# EAGLE schematic Final_board_R1_1 (EAGLE 7.2.0)
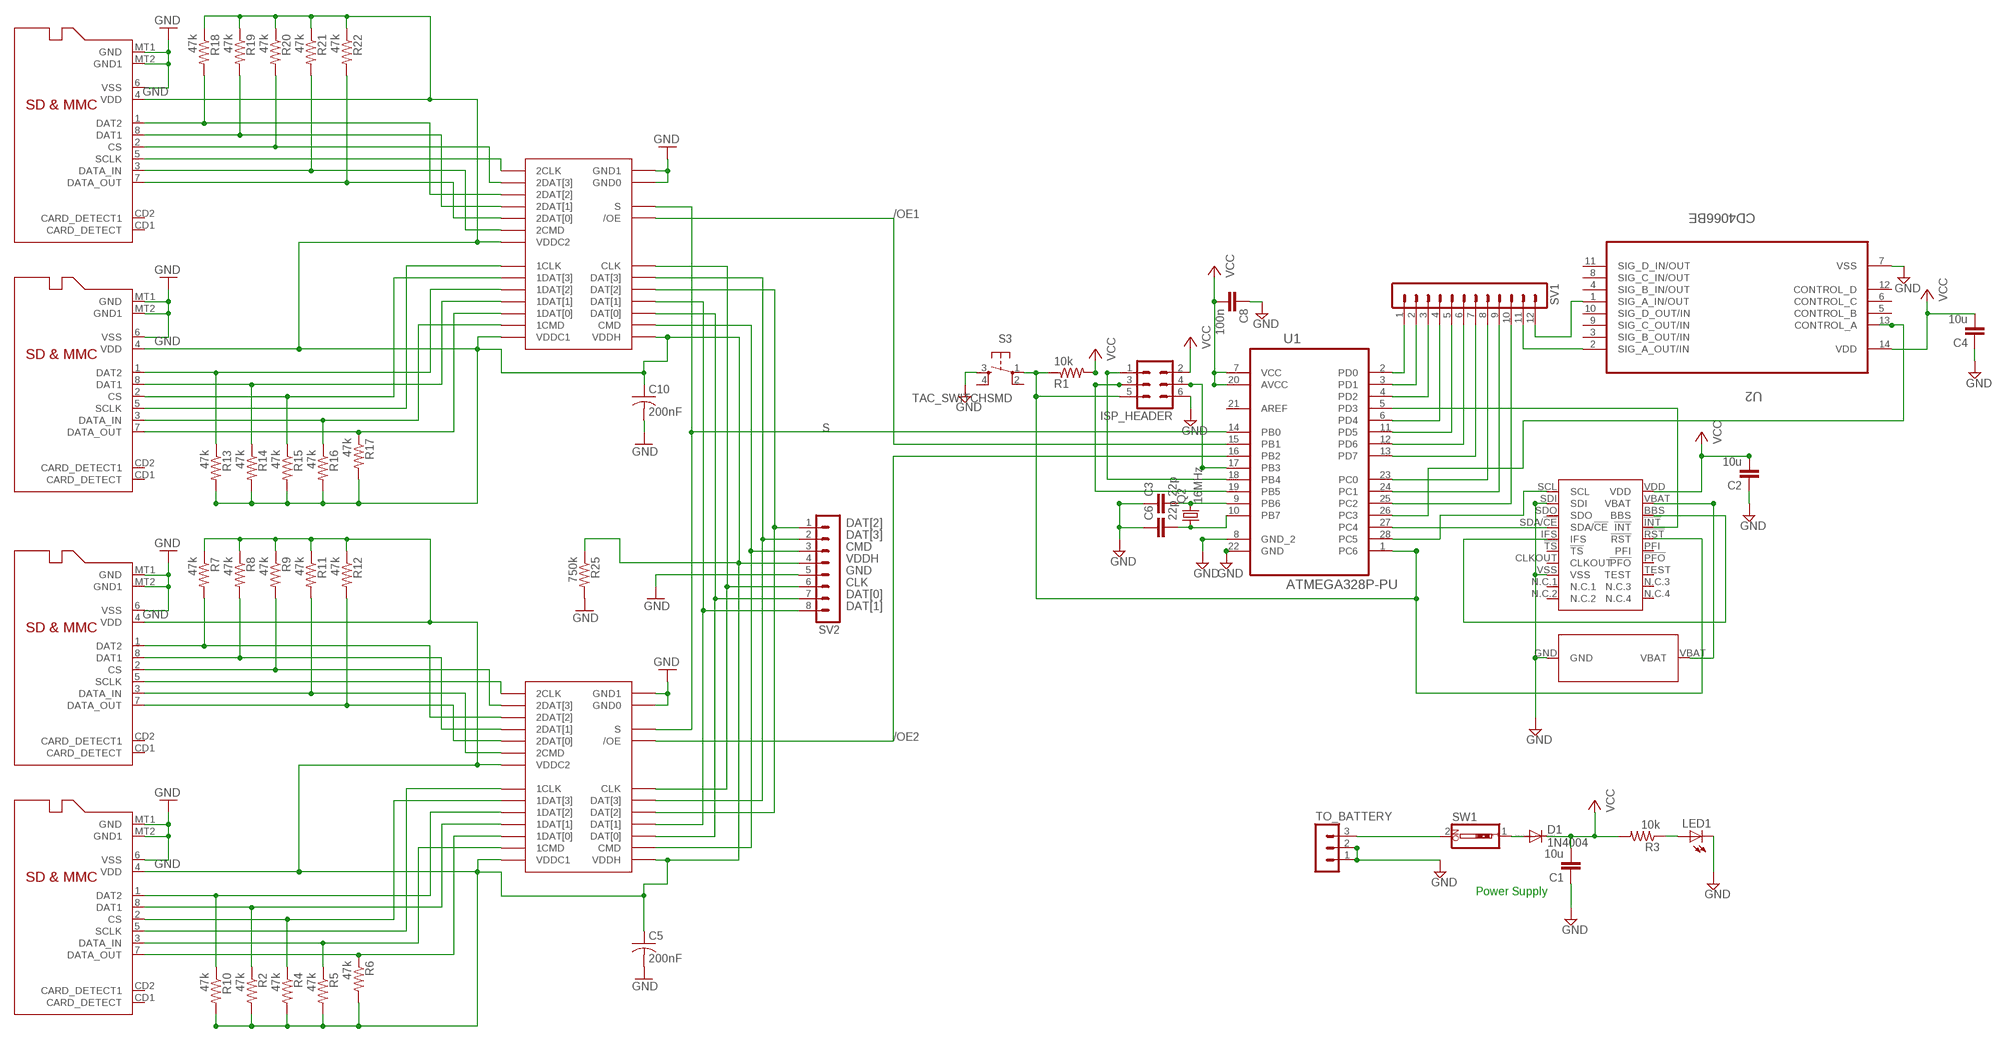
[diagram p0: schematic, sheet 1]

## Parts
+3.6V  FSSD06  [MLP-24]
+3.6V1  FSSD06  [MLP-24]
C1  10u  C-EUC0805  [C0805]
C2  10u  C-EUC0805  [C0805]
C3  22p  C-EUC0805  [C0805]
C4  10u  C-EUC0805  [C0805]
C5  200nF  C-USC0805  [C0805]
C6  22p  C-EUC0805  [C0805]
C8  100n  C-EUC0805  [C0805]
C10  200nF  C-USC0805  [C0805]
D1  1N4004  [DO41-10]
ISP_HEADER  MA03-2  [MA03-2]
LED1  LEDCHIPLED_0805  [CHIPLED_0805]
Q2  16MHz  CRYSTALHC49S  [HC49/S]
R1  10k  R-US_R0805  [R0805]
R2  47k  R-US_R0805  [R0805]
R3  10k  R-US_R0805  [R0805]
R4  47k  R-US_R0805  [R0805]
R5  47k  R-US_R0805  [R0805]
R6  47k  R-US_R0805  [R0805]
R7  47k  R-US_R0805  [R0805]
R8  47k  R-US_R0805  [R0805]
R9  47k  R-US_R0805  [R0805]
R10  47k  R-US_R0805  [R0805]
R11  47k  R-US_R0805  [R0805]
R12  47k  R-US_R0805  [R0805]
R13  47k  R-US_R0805  [R0805]
R14  47k  R-US_R0805  [R0805]
R15  47k  R-US_R0805  [R0805]
R16  47k  R-US_R0805  [R0805]
R17  47k  R-US_R0805  [R0805]
R18  47k  R-US_R0805  [R0805]
R19  47k  R-US_R0805  [R0805]
R20  47k  R-US_R0805  [R0805]
R21  47k  R-US_R0805  [R0805]
R22  47k  R-US_R0805  [R0805]
R25  750k  R-US_R0805  [R0805]
S3  TAC_SWITCHSMD  [TACTILE-SWITCH-SMD]
SV1  MA12-1W  [MA12-1W]
SV2  MA08-1  [MA08-1]
SW1  SW_DIP-1  [EDG-01]
TO_BATTERY  MA03-1  [MA03-1]
U1  ATMEGA328P-PU  [DIP254P762X457-28]
U2  CD4066BE  [DIP254P762X508-14]
U$1  RTC  [N5]
U$2  CR2032  [S8421R]
USD1  MICROSD  [MICROSD]
USD2  MICROSD  [MICROSD]
USD3  MICROSD  [MICROSD]
USD4  MICROSD  [MICROSD]

## Nets
/OE1: +3.6V1./OE U1.15(PB1)
/OE2: +3.6V./OE U1.16(PB2)
CLK: +3.6V1.CLK +3.6V.CLK SV2.6
CMD: +3.6V1.CMD +3.6V.CMD SV2.3
DAT[0]: +3.6V1.DAT[0] +3.6V.DAT[0] SV2.7
DAT[1]: +3.6V1.DAT[1] +3.6V.DAT[1] SV2.8
DAT[2]: +3.6V1.DAT[2] +3.6V.DAT[2] SV2.1
DAT[3]: +3.6V1.DAT[3] +3.6V.DAT[3] SV2.2
GND: +3.6V1.GND0 +3.6V1.GND1 +3.6V.GND0 +3.6V.GND1 C1.1 C2.1 C3.1 C4.1 C5.2 C6.1 C8.1 C10.2 ISP_HEADER.6 LED1.C R25.2 S3.3 SV2.5 TO_BATTERY.1 TO_BATTERY.2 U1.8(GND_2) U1.22(GND) U2.7(VSS) U$1.SDI U$1.VSS U$2.GND USD1.6(VSS) USD1.MT1(GND) USD1.MT2(GND1) USD2.6(VSS) USD2.MT1(GND) USD2.MT2(GND1) USD3.6(VSS) USD3.MT1(GND) USD3.MT2(GND1) USD4.6(VSS) USD4.MT1(GND) USD4.MT2(GND1)
N$1: +3.6V.1DAT[0] R6.1 USD1.7(DATA_OUT)
N$2: LED1.A R3.1
N$3: D1.A SW1.1
N$4: U1.27(PC4) U$1.SDA/!CE
N$5: ISP_HEADER.5 R1.1 S3.1 U1.1(PC6) U$1.!RST
N$6: SV1.1 U1.2(PD0)
N$7: SV1.2 U1.3(PD1)
N$8: C3.2 Q2.2 U1.9(PB6)
N$10: C6.2 Q2.1 U1.10(PB7)
N$11: ISP_HEADER.3 U1.19(PB5)
N$12: SV1.3 U1.4(PD2)
N$13: SV1.4 U1.6(PD4)
N$14: U1.28(PC5) U$1.SCL
N$15: U$1.VBAT U$2.VBAT
N$16: SV1.5 U1.11(PD5)
N$17: SV1.6 U1.12(PD6)
N$18: SV1.7 U1.13(PD7)
N$19: SV1.8 U1.23(PC0)
N$20: SW1.2 TO_BATTERY.3
N$21: U$1.BBS U$1.IFS
N$22: SV1.9 U1.24(PC1)
N$23: SV1.10 U1.25(PC2)
N$24: U1.26(PC3) U2.13(CONTROL_A)
N$25: U1.5(PD3) U$1.!INT
N$26: SV1.11 U2.2(SIG_A_OUT/IN)
N$27: SV1.12 U2.1(SIG_A_IN/OUT)
N$28: +3.6V.1DAT[1] R2.1 USD1.8(DAT1)
N$29: +3.6V.1DAT[2] R10.1 USD1.1(DAT2)
N$30: +3.6V.1CMD R5.1 USD1.3(DATA_IN)
N$31: +3.6V.1CLK USD1.5(SCLK)
N$32: +3.6V.2DAT[3] R9.2 USD2.2(CS)
N$33: +3.6V.2DAT[0] R12.2 USD2.7(DATA_OUT)
N$34: +3.6V.2DAT[1] R8.2 USD2.8(DAT1)
N$35: +3.6V.2DAT[2] R7.2 USD2.1(DAT2)
N$36: +3.6V.2CMD R11.2 USD2.3(DATA_IN)
N$37: +3.6V.2CLCK(2CLK) USD2.5(SCLK)
N$38: +3.6V.1DAT[3] R4.1 USD1.2(CS)
N$39: +3.6V1.1DAT[0] R17.1 USD3.7(DATA_OUT)
N$40: +3.6V1.1DAT[1] R14.1 USD3.8(DAT1)
N$41: +3.6V1.1DAT[2] R13.1 USD3.1(DAT2)
N$42: +3.6V1.1CMD R16.1 USD3.3(DATA_IN)
N$43: +3.6V1.1CLK USD3.5(SCLK)
N$44: +3.6V1.2DAT[3] R20.2 USD4.2(CS)
N$45: +3.6V1.2DAT[0] R22.2 USD4.7(DATA_OUT)
N$46: +3.6V1.2DAT[1] R19.2 USD4.8(DAT1)
N$47: +3.6V1.2DAT[2] R18.2 USD4.1(DAT2)
N$48: +3.6V1.2CMD R21.2 USD4.3(DATA_IN)
N$49: +3.6V1.2CLCK(2CLK) USD4.5(SCLK)
N$50: +3.6V1.1DAT[3] R15.1 USD3.2(CS)
N$60: ISP_HEADER.1 U1.18(PB4)
N$61: ISP_HEADER.4 U1.17(PB3)
S: +3.6V1.S +3.6V.S U1.14(PB0)
VCC: C1.2 C2.2 C4.2 C8.2 D1.C ISP_HEADER.2 R1.2 R3.2 U1.7(VCC) U1.20(AVCC) U2.14(VDD) U$1.VDD
VDDH: +3.6V1.VDDC1 +3.6V1.VDDC2 +3.6V1.VDDH +3.6V.VDDC1 +3.6V.VDDC2 +3.6V.VDDH C5.1 C10.1 R2.2 R4.2 R5.2 R6.2 R7.1 R8.1 R9.1 R10.2 R11.1 R12.1 R13.2 R14.2 R15.2 R16.2 R17.2 R18.1 R19.1 R20.1 R21.1 R22.1 R25.1 SV2.4 USD1.4(VDD) USD2.4(VDD) USD3.4(VDD) USD4.4(VDD)
Unconnected: S3.2 S3.4 U1.21(AREF) U2.3(SIG_B_OUT/IN) U2.4(SIG_B_IN/OUT) U2.5(CONTROL_B) U2.6(CONTROL_C) U2.8(SIG_C_IN/OUT) U2.9(SIG_C_OUT/IN) U2.10(SIG_D_OUT/IN) U2.11(SIG_D_IN/OUT) U2.12(CONTROL_D) U$1.!PFO U$1.!TS U$1.CLKOUT U$1.N.C.1 U$1.N.C.2 U$1.N.C.3 U$1.N.C.4 U$1.PFI U$1.SDO U$1.TEST USD1.CD1(CARD_DETECT) USD1.CD2(CARD_DETECT1) USD2.CD1(CARD_DETECT) USD2.CD2(CARD_DETECT1) USD3.CD1(CARD_DETECT) USD3.CD2(CARD_DETECT1) USD4.CD1(CARD_DETECT) USD4.CD2(CARD_DETECT1)

## Notes on the sheet
- Power Supply

## Library data of the parts
+3.6V +3.6V1 = FSSD06_MLP24a:FSSD06
C1-C4 C6 C8 = rcl:C-EU: CAPACITOR, European symbol
C5 C10 = rcl:C-US: CAPACITOR, American symbol
D1 = diode:1N4004: DIODE general purpose rectifier, 1 A
ISP_HEADER = con-lstb:MA03-2: PIN HEADER; OC_FARNELL: unknown; OC_NEWARK: unknown
LED1 = led:LED: LED OSRAM: - CHIPLED LG R971, LG N971, LY N971, LG Q971, LY Q971, LO R971, LY R971 LH N974, LH R974 LS Q976, LO Q976, LY Q976 LO Q996 - Hyper CHIPLED LW Q18S LB Q993, LB Q99A, LB R99A - SideLED LS A670, LO A670, LY A670, LG A670, LP A670 LB A673, LV A673, LT A673, LW A673 LH A674 LY A675 LS A676, LA A676, LO A676, LY A676, LW A676 LS A679, LY A679, LG A679 - Hyper Micro SIDELED® LS Y876, LA Y876, LO Y876, LY Y876 LT Y87S - SmartLED LW L88C, LW L88S LB L89C, LB L89S, LG L890 LS L89K, LO L89K, LY L89K LS L896, LA L896, LO L896, LY L896 - TOPLED LS T670, LO T670, LY T670, LG T670, LP T670 LSG T670, LSP T670, LSY T670, LOP T670, LYG T670 LG T671, LOG T671, LSG T671 LB T673, LV T673, LT T673, LW T673 LH T674 LS T676, LA T676, LO T676, LY T676, LB T676, LH T676, LSB T676, LW T676 LB T67C, LV T67C, LT T67C, LS T67K, LO T67K, LY T67K, LW E67C LS E67B, LA E67B, LO E67B, LY E67B, LB E67C, LV E67C, LT E67C LW T67C LS T679, LY T679, LG T679 LS T770, LO T770, LY T770, LG T770, LP T770 LB T773, LV T773, LT T773, LW T773 LH T774 LS E675, LA E675, LY E675, LS T675 LS T776, LA T776, LO T776, LY T776, LB T776 LHGB T686 LT T68C, LB T68C - Hyper Mini TOPLED® LB M676 - Mini TOPLED Santana® LG M470 LS M47K, LO M47K, LY M47K Source: http://www.osram.convergy.de LUXEON: - LUMILED® LXK2-PW12-R00, LXK2-PW12-S00, LXK2-PW14-U00, LXK2-PW14-V00 LXK2-PM12-R00, LXK2-PM12-S00, LXK2-PM14-U00 LXK2-PE12-Q00, LXK2-PE12-R00, LXK2-PE12-S00, LXK2-PE14-T00, LXK2-PE14-U00 LXK2-PB12-K00, LXK2-PB12-L00, LXK2-PB12-M00, LXK2-PB14-N00, LXK2-PB14-P00, LXK2-PB14-Q00 LXK2-PR12-L00, LXK2-PR12-M00, LXK2-PR14-Q00, LXK2-PR14-R00 LXK2-PD12-Q00, LXK2-PD12-R00, LXK2-PD12-S00 LXK2-PH12-R00, LXK2-PH12-S00 LXK2-PL12-P00, LXK2-PL12-Q00, LXK2-PL12-R00 Source: www.luxeon.com KINGBRIGHT: KA-3528ASYC Source: www.kingbright.com
Q2 = crystal:CRYSTAL: CRYSTAL; OC_FARNELL: 1667008; OC_NEWARK: unknown
R1-R22 R25 = rcl:R-US_: RESISTOR, American symbol
S3 = SparkFun-Electromechanical:TAC_SWITCH: Momentary Switch Button commonly used for reset or general input. Spark Fun Electronics SKU : COM-00097 SMT- SWCH-08247; PROD_ID: SWCH-08247
SV1 = con-lstb:MA12-1W: PIN HEADER; OC_FARNELL: unknown; OC_NEWARK: unknown
SV2 = con-lstb:MA08-1: PIN HEADER; OC_FARNELL: unknown; OC_NEWARK: unknown
SW1 = special:SW_DIP-1: DIP SWITCH
TO_BATTERY = con-lstb:MA03-1: PIN HEADER; OC_FARNELL: unknown; OC_NEWARK: unknown
U1 = Atmel_By_element14_Batch_1-00:ATMEGA328P-PU: 8-bit Microcontroller with In-System Programmable Flash; MPN: ATMEGA328P-PU; OC_FARNELL: 1715487; OC_NEWARK: 15R0268; PACKAGE: PDIP-28; SUPPLIER: Atmel
U2 = Texas Instruments_By_element14_Batch_1:CD4066BE: CMOS Quad Bilateral Switch; MPN: CD4066BE; OC_FARNELL: 1106112; OC_NEWARK: 60K5124; PACKAGE: PDIP-14; SUPPLIER: Texas Instruments
U$1 = soic20:RTC
U$2 = CR2032:CR2032
USD1-USD4 = adafruit:MICROSD: Micro-SD / Transflash card holder with SPI pinout For the 3M # 2908-05WB-MG and/or 4UCON #19656 push-push type